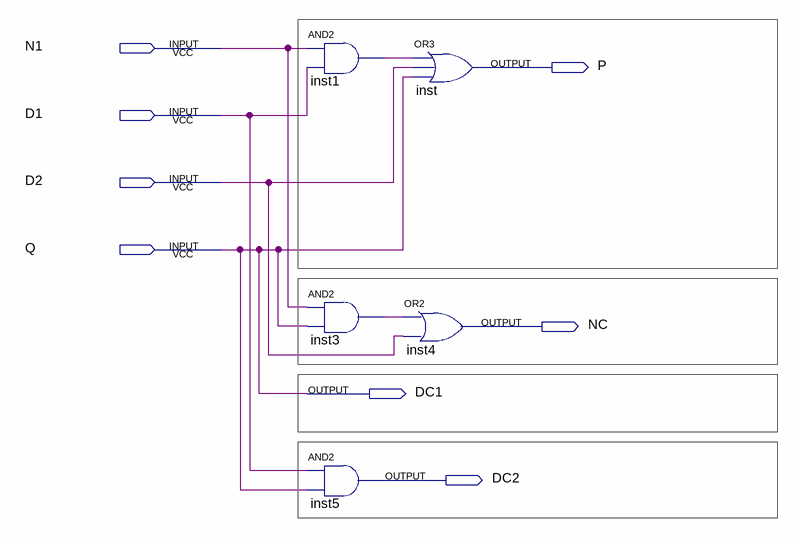
[diagram p0: schematic sheet]
// Quartus schematic Lab9.bdf as structural Verilog: 5 symbols, 8 pins
module Lab9 (
  input  N1,
  input  D1,
  input  D2,
  input  Q,
  output P,
  output NC,
  output DC1,
  output DC2
);

  wire inst1_out, inst3_out;

  and inst1 (inst1_out, N1, D1);
  and inst3 (inst3_out, N1, Q);
  and inst5 (DC2, D1, Q);
  or inst (P, inst1_out, D2, Q);
  or inst4 (NC, inst3_out, D2);

  assign DC1 = Q;
endmodule
